# EAGLE design ControlORGANIZED (EAGLE 7.1.0)
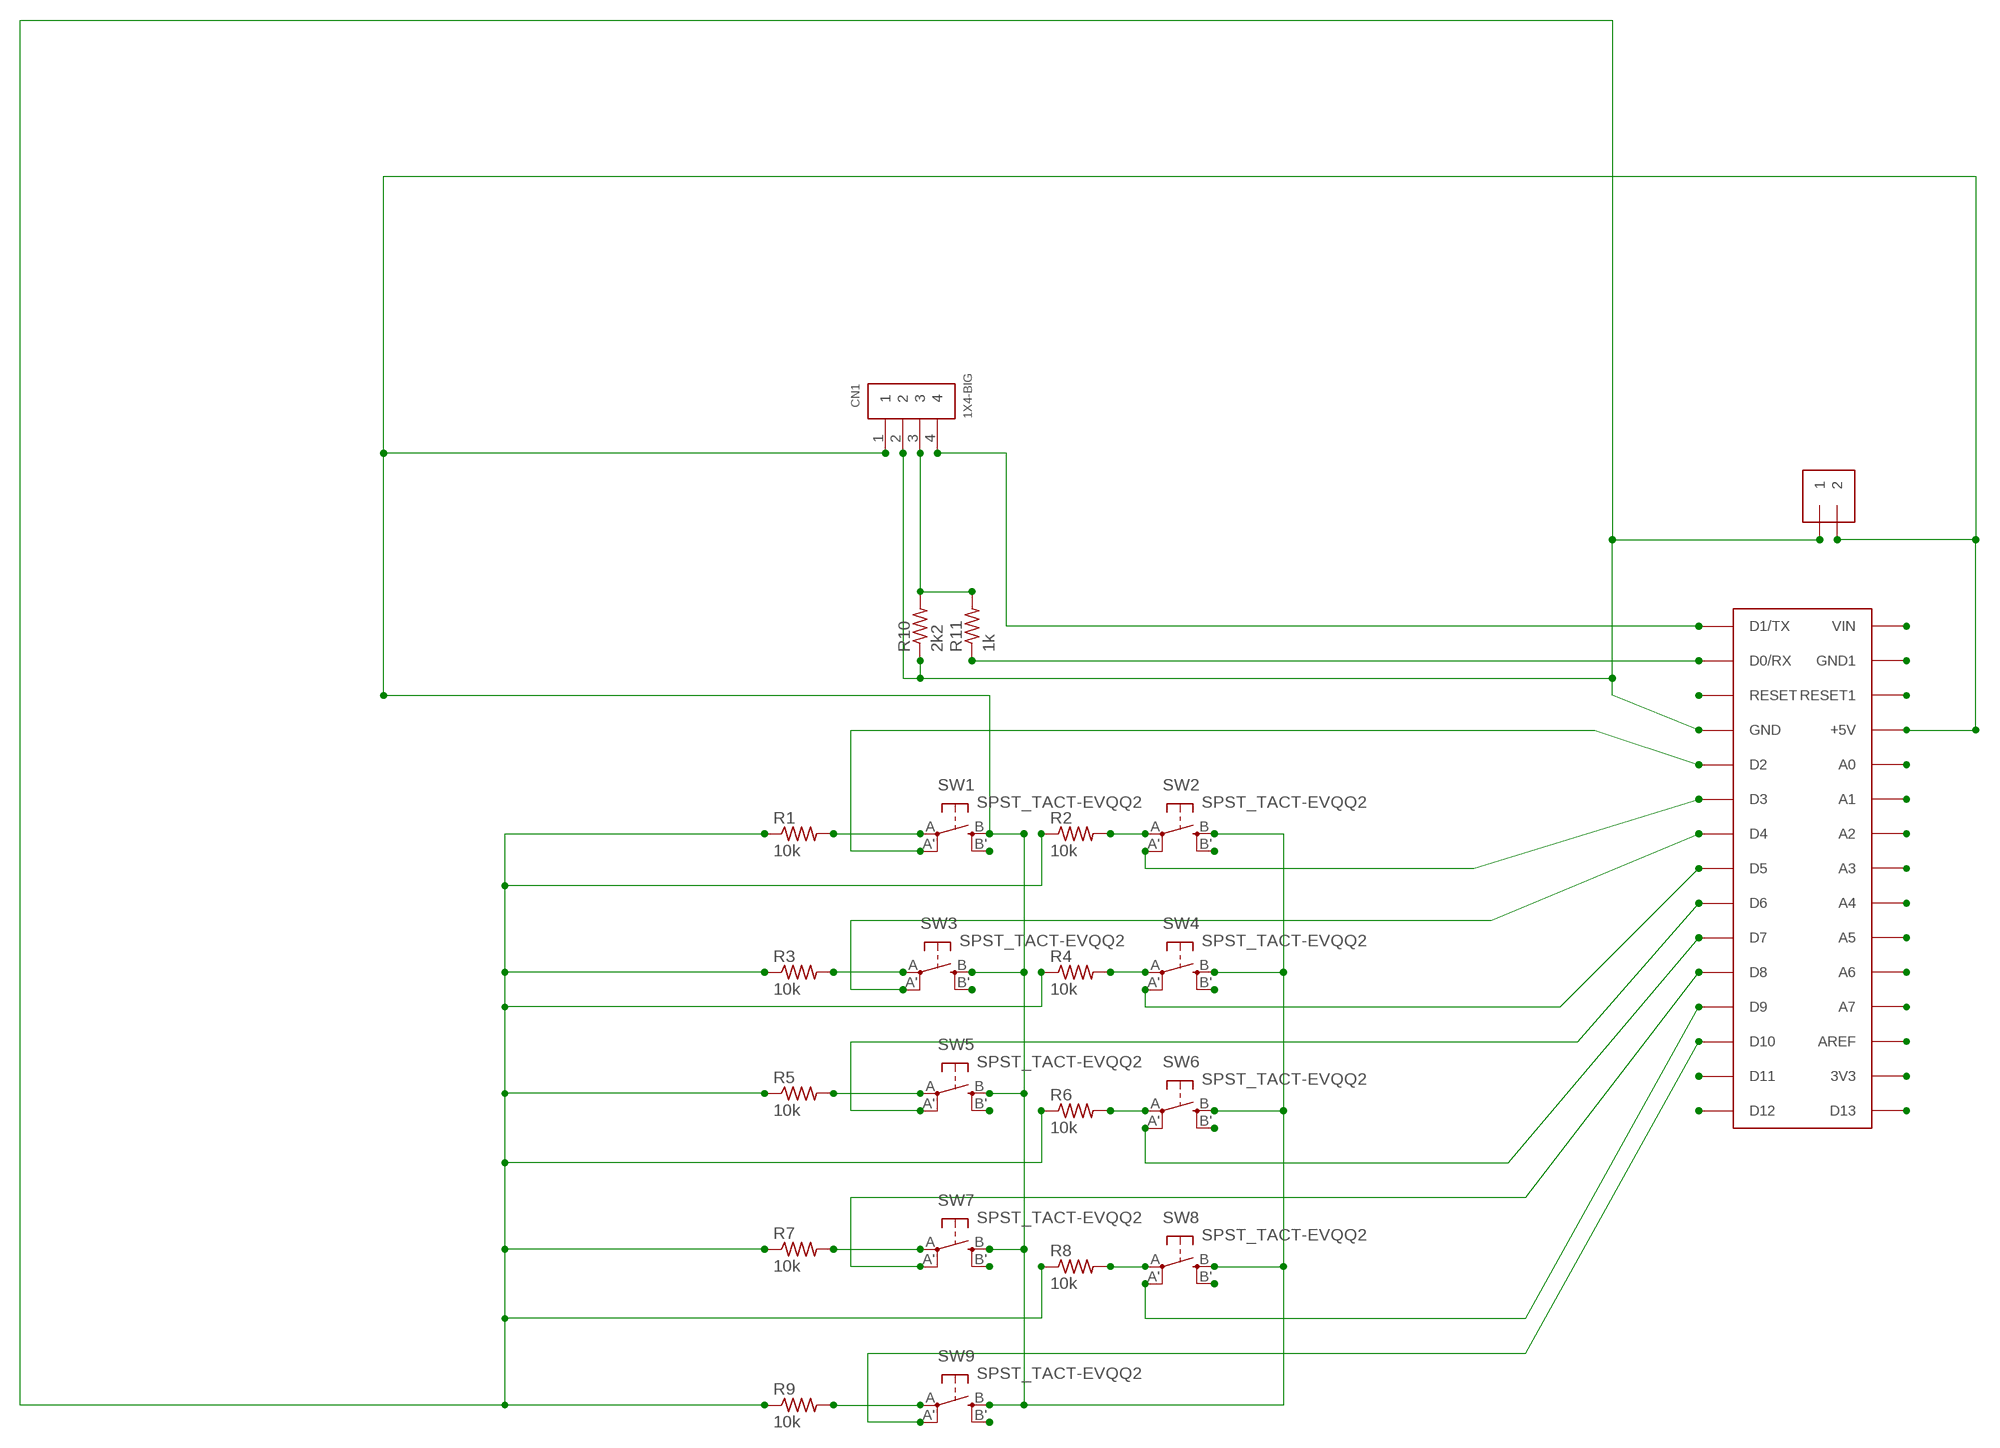
[diagram p0: schematic, sheet 1]

## Parts
CN1  1X4-BIG  [1X04-BIG]
J1  1X2-3.5MM  [1X2-3.5MM]
R1  10k  R-US_0204/7  [0204/7]
R2  10k  R-US_0204/7  [0204/7]
R3  10k  R-US_0204/7  [0204/7]
R4  10k  R-US_0204/7  [0204/7]
R5  10k  R-US_0204/7  [0204/7]
R6  10k  R-US_0204/7  [0204/7]
R7  10k  R-US_0204/7  [0204/7]
R8  10k  R-US_0204/7  [0204/7]
R9  10k  R-US_0204/7  [0204/7]
R10  2k2  R-US_0204/7  [0204/7]
R11  1k  R-US_0204/7  [0204/7]
SW1  SPST_TACT-EVQQ2  [EVQ-Q2]
SW2  SPST_TACT-EVQQ2  [EVQ-Q2]
SW3  SPST_TACT-EVQQ2  [EVQ-Q2]
SW4  SPST_TACT-EVQQ2  [EVQ-Q2]
SW5  SPST_TACT-EVQQ2  [EVQ-Q2]
SW6  SPST_TACT-EVQQ2  [EVQ-Q2]
SW7  SPST_TACT-EVQQ2  [EVQ-Q2]
SW8  SPST_TACT-EVQQ2  [EVQ-Q2]
SW9  SPST_TACT-EVQQ2  [EVQ-Q2]
U$1  ARDUINONANO  [ARDUINOMICRO]  (not placed on a sheet)
U$2  ARDUINONANO  [ARDUINOMICRO]  (not placed on a sheet)
U$3  ARDUINONANO  [ARDUINOMICRO]  (not placed on a sheet)
U$4  ARDUINONANO  [ARDUINOMICRO]  (not placed on a sheet)
U$5  ARDUINONANO  [ARDUINOMICRO]  (not placed on a sheet)
U$6  ARDUINONANO  [ARDUINOMICRO]  (not placed on a sheet)
U$7  ARDUINONANO  [ARDUINOMICRO]  (not placed on a sheet)
U$8  ARDUINONANO  [PDIP-32]

## Nets
N$1: R2.2 SW2.A(P)
N$3: R6.2 SW6.A(P)
N$4: R8.2 SW8.A(P)
N$9: R7.2 SW7.A(P)
N$12: R5.2 SW5.A(P)
N$15: R1.2 SW1.A(P)
N$19: CN1.1 J1.2 SW1.B(S) SW2.B(S) SW3.B(S) SW4.B(S) SW5.B(S) SW6.B(S) SW7.B(S) SW8.B(S) SW9.B(S) U$8.+5V
N$21: CN1.3 R10.2 R11.2
N$23: CN1.2 J1.1 R1.1 R2.1 R3.1 R4.1 R5.1 R6.1 R7.1 R8.1 R9.1 R10.1 U$8.GND
N$24: R11.1 U$8.D0/RX
N$27: SW1.B'(S1)
N$28: SW2.B'(S1)
N$29: SW4.B'(S1)
N$30: SW6.B'(S1)
N$31: SW5.B'(S1)
N$32: SW5.A'(P1) U$8.D6
N$36: SW6.A'(P1) U$8.D7
N$39: R4.2 SW4.A(P)
N$40: SW4.A'(P1) U$8.D5
N$41: SW3.B'(S1)
N$43: SW3.A'(P1) U$8.D4
N$44: R3.2 SW3.A(P)
N$46: SW1.A'(P1) U$8.D2
N$49: SW2.A'(P1) U$8.D3
N$51: U$8.D12
N$52: U$8.D11
N$56: CN1.4 U$8.D1/TX
N$58: U$8.RESET
N$62: SW7.A'(P1) U$8.D8
N$63: SW7.B'(S1)
N$65: SW8.B'(S1)
N$66: U$8.VIN
N$67: U$8.GND1
N$68: U$8.RESET1
N$70: U$8.A0
N$71: U$8.A1
N$72: U$8.A2
N$73: U$8.A3
N$74: U$8.A4
N$75: U$8.A5
N$76: U$8.A6
N$77: U$8.A7
N$78: U$8.AREF
N$79: U$8.3V3
N$80: U$8.D13
N$81: SW8.A'(P1) U$8.D9
N$83: SW9.B'(S1)
N$86: R9.2 SW9.A(P)
N$87: SW9.A'(P1) U$8.D10

## Library data of the parts
CN1 = adafruit-modified:1X4: 4-pin connector
J1 = adafruit-modified:1X2: 3.5mm Terminal block http://www.ladyada.net/library/pcb/eaglelibrary.html
R1-R11 = adafruit-modified:R-US_: RESISTOR, American symbol
SW1-SW9 = adafruit-modified:SPST_TACT: SMT 6mm switch, EVQQ2 series http://www.ladyada.net/library/eagle
U$1-U$7 = adafruit-modified:ARDUINONANO
U$8 = arduino:ARDUINONANO

## Board
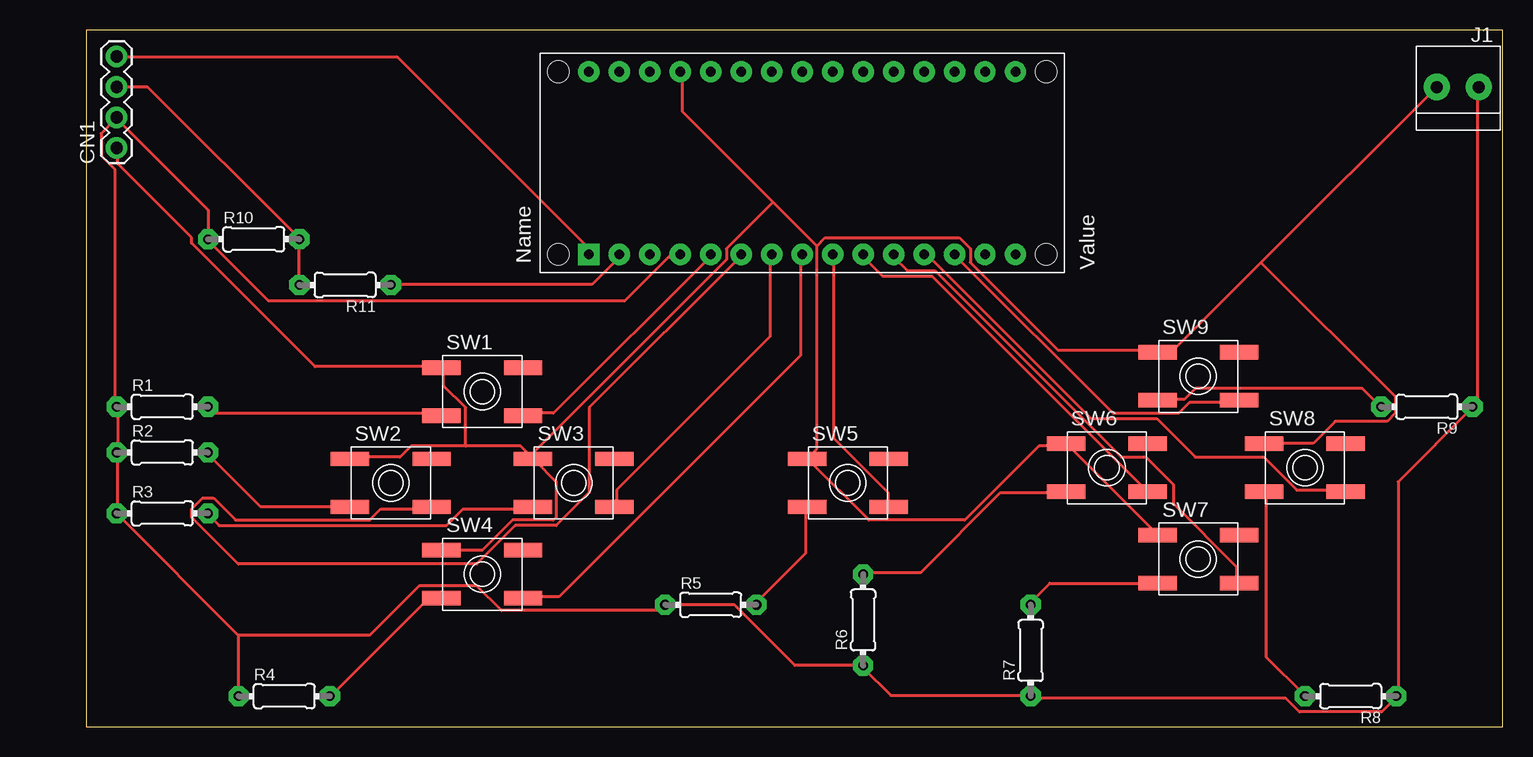
[diagram p1: board, top side]
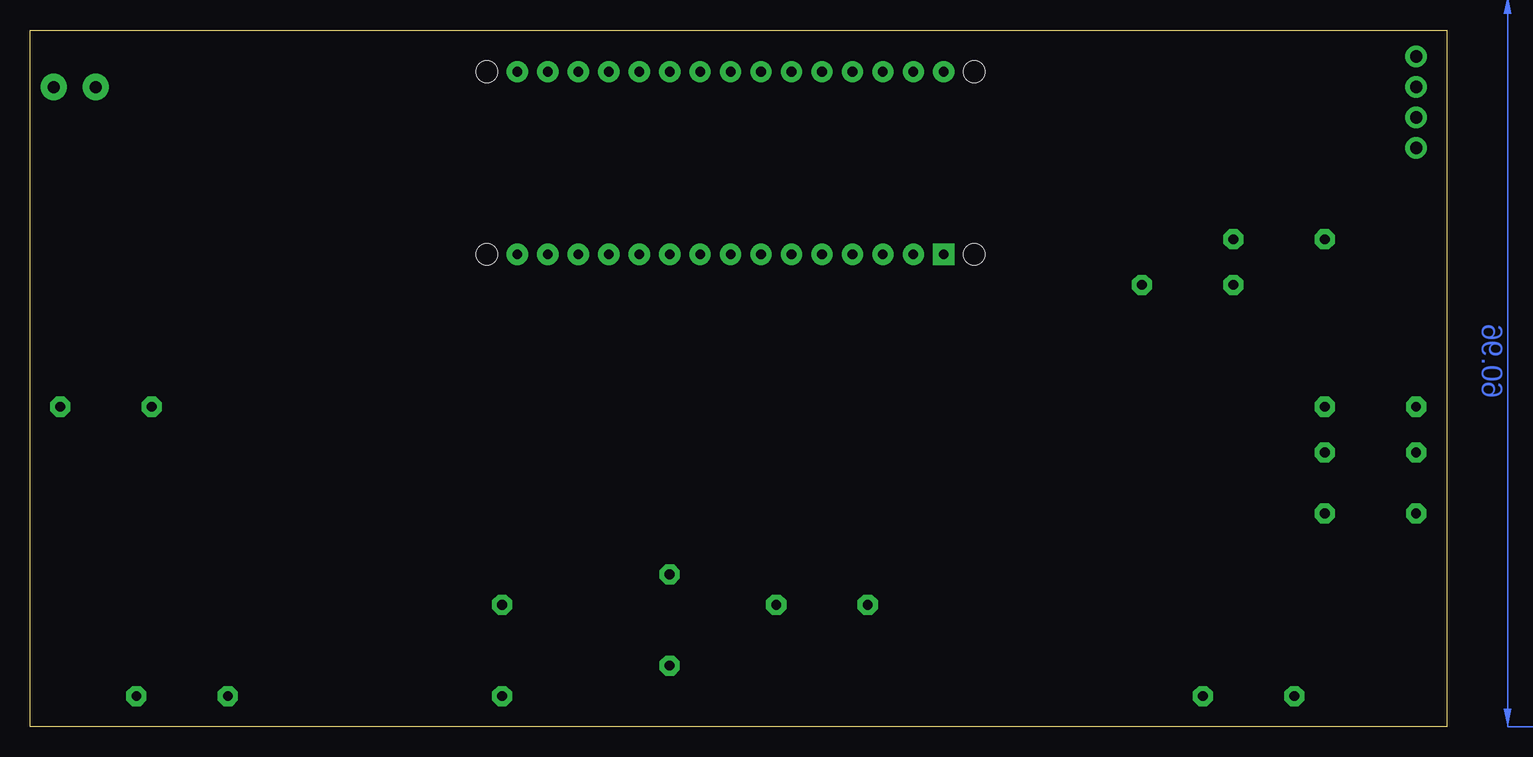
[diagram p2: board, bottom side, seen from below]

Size 118.09 x 58.09 mm. Coordinates in mm from the lower left corner, seen from the top.
Outline: 0,0 118.09,0 118.09,58.09 0,58.09 0,0
Copper layers (1*16): Top 0.035mm / dielectric 1.5mm / Bottom 0.035mm
Design rules "default": minimum track width 10mil, minimum drill 24mil, track to track 8mil, track to pad 8mil, pad to pad 8mil, via to via 8mil, smd to smd 8mil, copper to edge 40mil, drill to drill 8mil, minimum pad ring 10mil, minimum via ring 8mil, stop-mask expansion 4mil, vias tented up to drill 0mil, thermal gap 10mil

### Footprints (pad centres in the part's own frame; a part is rotated, then mirrored left to right if it is on the bottom)
1X04-BIG = drill 1.016 pad 1.778: 1 0,0; 2 2.54,0; 3 5.08,0; 4 7.62,0
1X2-3.5MM = drill 1 pad 2.184: 1 1.8,0; 2 -1.7,0
0204/7 = drill 0.813 pad 1.676 octagon: 1 -3.81,0; 2 3.81,0
EVQ-Q2 = smd 3.2 x 1.2: A -3.4,-2; A' 3.4,-2; B -3.4,2; B' 3.4,2
PDIP-32 = drill 0.8 pad 1.778: 3V3 15.24,-35.56; +5V 15.24,-10.16; A0 15.24,-12.7; A1 15.24,-15.24; A2 15.24,-17.78; A3 15.24,-20.32; A4 15.24,-22.86; A5 15.24,-25.4; A6 15.24,-27.94; A7 15.24,-30.48; AREF 15.24,-33.02; D0/RX 0,-5.08; D2 0,-12.7; D3 0,-15.24; D4 0,-17.78; D5 0,-20.32; D6 0,-22.86; D7 0,-25.4; D8 0,-27.94; D9 0,-30.48; D10 0,-33.02; D11 0,-35.56; D12 0,-38.1; D13 15.24,-38.1; GND 0,-10.16; GND1 15.24,-5.08; RESET 0,-7.62; RESET1 15.24,-7.62; VIN 15.24,-2.54 | drill 0.8 pad 1.778 square: D1/TX 0,-2.54 | hole 1.778: 0,0; 0,-40.64; 15.24,-40.64; 15.24,0

### Placement (x,y rotation side)
CN1  2.54,48.26 90 top
J1  114.3,53.34 0 top
R1  6.35,26.67 0 top
R2  6.35,22.86 0 top
R3  6.35,17.78 0 top
R4  16.51,2.54 0 top
R5  52.07,10.16 0 top
R6  64.77,8.89 90 top
R7  78.74,6.35 90 top
R8  105.41,2.54 180 top
R9  111.76,26.67 180 top
R10  13.97,40.64 0 top
R11  21.59,36.83 180 top
SW1  33.02,27.94 0 top
SW2  25.4,20.32 0 top
SW3  40.64,20.32 0 top
SW4  33.02,12.7 0 top
SW5  63.5,20.32 0 top
SW6  85.09,21.59 0 top
SW7  92.71,13.97 0 top
SW8  101.6,21.59 0 top
SW9  92.71,29.21 0 top
U$8  39.37,39.37 90 top

### Tracks (layer width: path | path; a pad name or v marks a point on that pad's centre or on a via)
N$1
  Top 0.254: SW2.A 21.82,18.36 14.5,18.36 10.16,22.71 R2.2
N$3
  Top 0.254: SW6.A 81.48,19.51 76.23,19.51 69.6,12.88 64.8,12.88 R6.2
N$4
  Top 0.254: SW8.A 98.4,19.51 98.4,5.79 101.6,2.59 R8.2
N$9
  Top 0.254: SW7.A 89.26,11.96 80.34,11.96 78.74,10.36 R7.2
N$12
  Top 0.254: SW5.A 59.99,18.14 59.99,14.48 55.88,10.36 R5.2
N$15
  Top 0.254: SW1.A 29.59,26.14 10.62,26.14 10.16,26.59 R1.2
N$19
  Top 0.254: 31.65,23.39 36.22,23.39 37.13,22.48 SW3.B | 31.65,23.39 27.08,23.39 26.16,22.48 22.05,22.48 SW2.B | SW4.B 29.82,14.71 33.02,14.71 35.53,17.22 38.96,17.22 39.19,17.45 39.19,20.42 37.36,22.25 SW3.B | 31.65,23.39 31.65,26.59 29.82,28.42 29.82,29.79 SW1.B 29.59,30.02 19.07,30.02 8.79,40.31 8.79,40.77 2.62,46.94 2.62,48.08 CN1.1 | 97.94,38.71 112.57,53.34 J1.2 | 97.94,38.71 90.63,31.39 89.48,31.39 SW9.B 89.26,31.39 81.03,31.39 73.71,38.71 73.71,39.85 72.8,40.77 61.59,40.77 60.91,40.08 | 97.94,38.71 109.14,27.51 109.14,26.14 108.46,25.45 104.12,25.45 102.29,23.62 98.4,23.62 SW8.B | SW7.B 89.26,16.08 81.71,23.62 SW6.B 81.48,23.39 79.43,23.39 73.25,17.22 65.25,17.22 60.22,22.25 SW5.B 60.22,22.48 60.91,23.17 60.91,40.08 | 60.91,40.08 57.25,43.74 | 57.25,43.74 49.71,51.28 49.71,54.48 U$8.+5V | 57.25,43.74 53.36,39.85 53.36,38.94 37.36,22.94 37.36,22.48 SW3.B
N$21
  Top 0.254: R11.2 17.7,36.88 17.7,40.54 R10.2 17.7,40.77 5.13,53.34 CN1.3
N$23
  Top 0.254: 12.68,7.62 12.68,2.59 R4.1 | 12.68,7.62 2.62,17.68 R3.1 2.62,17.91 2.62,22.71 R2.1 2.62,22.94 2.62,26.59 R1.1 2.39,26.82 2.39,46.48 1.25,47.62 1.25,49.45 2.39,50.6 CN1.2 2.62,50.6 10.16,43.05 R10.1 10.16,40.54 15.19,35.51 44.91,35.51 48.56,39.17 49.48,39.17 U$8.GND | J1.1 116,53.34 116,27.05 115.77,26.82 R9.1 115.55,26.59 109.37,20.42 109.37,2.59 R8.1 109.14,2.36 108,1.22 101.14,1.22 100,2.36 78.74,2.36 R7.1 78.74,2.59 67.08,2.59 64.8,4.88 R6.1 64.57,5.1 59.08,5.1 54.05,10.13 48.34,10.13 R5.1 48.11,10.13 47.65,9.68 34.62,9.68 32.56,11.73 27.76,11.73 23.65,7.62 12.68,7.62
N$24
  Top 0.254: R11.1 25.48,36.88 42.16,36.88 44.45,39.17 U$8.D0/RX
N$32
  Top 0.254: SW5.A' 66.85,18.36 66.85,19.51 62.28,24.08 62.28,39.17 U$8.D6
N$36
  Top 0.254: SW6.A' 88.34,19.74 70.51,37.57 66.4,37.57 64.8,39.17 U$8.D7
N$39
  Top 0.254: SW4.A 29.59,10.59 28.45,10.59 20.45,2.59 R4.2
N$40
  Top 0.254: SW4.A' 36.45,10.82 39.42,10.82 59.54,30.94 59.54,39.17 U$8.D5
N$43
  Top 0.254: SW3.A' 44.22,18.36 44.22,19.74 57.02,32.54 57.02,39.17 U$8.D4
N$44
  Top 0.254: SW3.A 37.13,18.14 31.42,18.14 30.05,16.76 11.07,16.76 10.16,17.68 R3.2
N$46
  Top 0.254: SW1.A' 36.45,26.14 38.96,26.14 51.99,39.17 U$8.D2
N$49
  Top 0.254: SW2.A' 28.68,18.14 24.56,18.14 23.65,17.22 12.45,17.22 10.62,19.05 9.7,19.05 8.79,18.14 8.79,17.45 12.68,13.56 32.56,13.56 35.76,16.76 39.19,16.76 41.93,19.51 41.93,26.59 54.51,39.17 U$8.D3
N$56
  Top 0.254: U$8.D1/TX 41.71,39.39 41.71,40.08 25.93,55.85 2.62,55.85 CN1.4
N$62
  Top 0.254: SW7.A' 95.89,12.19 95.89,13.33 90.63,18.59 90.63,20.19 88.34,22.48 86.28,22.48 70.74,38.02 68.45,38.02 67.31,39.17 U$8.D8
N$81
  Top 0.254: SW8.A' 104.8,19.74 100.91,19.74 98.17,22.48 92.46,22.48 89.26,25.68 83.77,25.68 70.05,39.39 U$8.D9
N$86
  Top 0.254: SW9.A 89.48,27.28 91.54,27.28 92.46,28.19 106.4,28.19 107.77,26.82 R9.2
N$87
  Top 0.254: SW9.A' 95.89,27.05 92,27.05 91.08,26.14 85.6,26.14 72.57,39.17 U$8.D10
(copper drawn outside any net)
  shapes: Bottom area x2